# EAGLE schematic battery_contact (EAGLE 9.5.0)
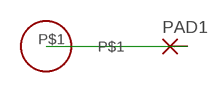
[diagram p0: schematic, sheet 1]

## Parts
PAD1  1,6/0,8  [1,6/0,8]
U$1  CONTACT_REGION  [CONTACT_REGION]

## Nets
N$1: PAD1.1(P) U$1.P$1

## Library data of the parts
PAD1 = wirepad:1,6/0,8: THROUGH-HOLE PAD
U$1 = custom_library:CONTACT_REGION